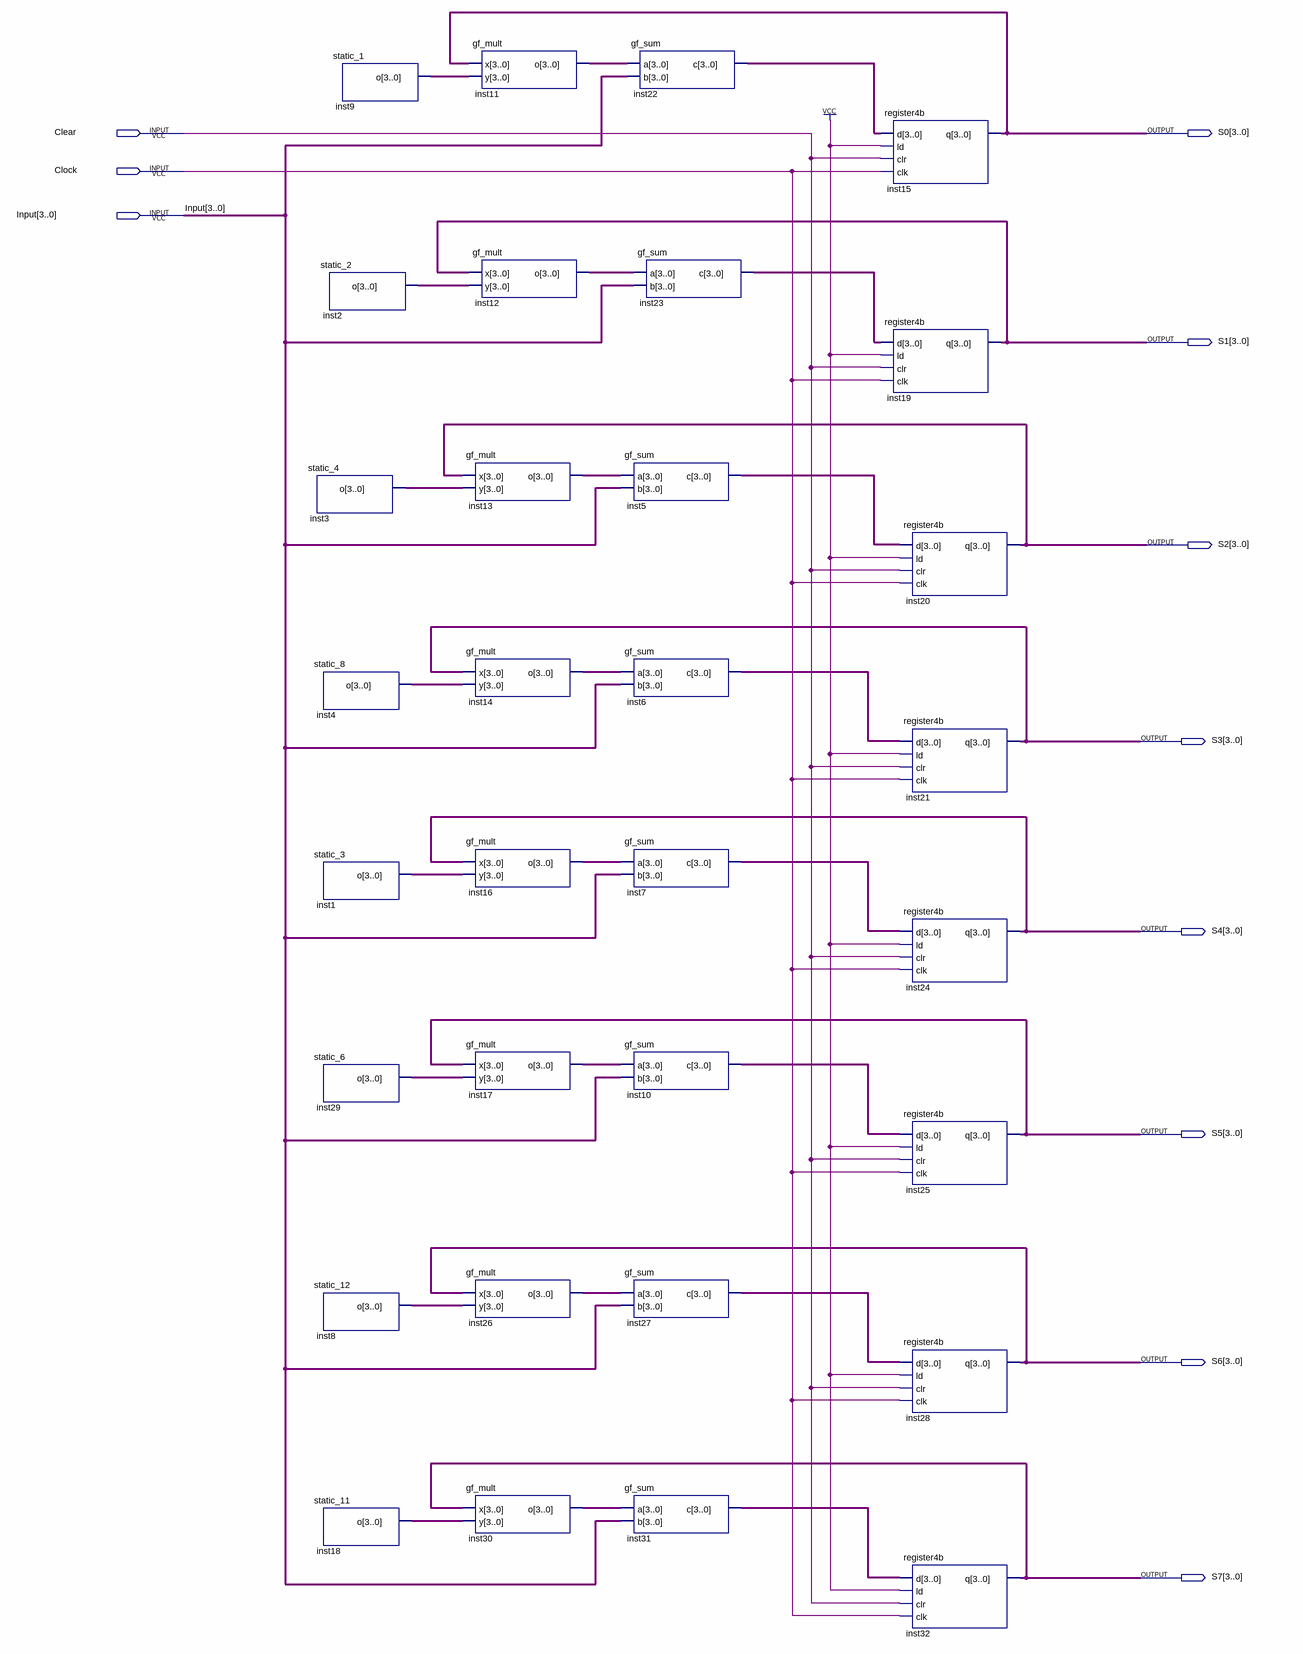
[diagram p0: schematic sheet]
// Quartus schematic Syndrome.bdf as structural Verilog: 32 symbols, 11 pins
module Syndrome (
  input  Clear,
  input  Clock,
  input  [3:0] Input,
  output [3:0] S0,
  output [3:0] S1,
  output [3:0] S2,
  output [3:0] S3,
  output [3:0] S4,
  output [3:0] S5,
  output [3:0] S6,
  output [3:0] S7
);

  wire [3:0] inst1_o, inst2_o, inst3_o, inst4_o, inst5_c, inst6_c, inst7_c, inst8_o, inst9_o, inst10_c,
       inst11_o, inst12_o, inst13_o, inst14_o, inst16_o, inst17_o, inst18_o, inst22_c, inst23_c, inst26_o,
       inst27_c, inst29_o, inst30_o, inst31_c;

  static_4 inst3 (.o(inst3_o));
  static_8 inst4 (.o(inst4_o));
  static_3 inst1 (.o(inst1_o));
  static_6 inst29 (.o(inst29_o));
  static_12 inst8 (.o(inst8_o));
  static_11 inst18 (.o(inst18_o));
  static_1 inst9 (.o(inst9_o));
  static_2 inst2 (.o(inst2_o));
  gf_mult inst13 (.x(S2), .y(inst3_o), .o(inst13_o));
  gf_mult inst14 (.x(S3), .y(inst4_o), .o(inst14_o));
  gf_mult inst16 (.x(S4), .y(inst1_o), .o(inst16_o));
  gf_mult inst17 (.x(S5), .y(inst29_o), .o(inst17_o));
  gf_mult inst26 (.x(S6), .y(inst8_o), .o(inst26_o));
  gf_mult inst30 (.x(S7), .y(inst18_o), .o(inst30_o));
  gf_mult inst11 (.x(S0), .y(inst9_o), .o(inst11_o));
  gf_mult inst12 (.x(S1), .y(inst2_o), .o(inst12_o));
  gf_sum inst22 (.a(inst11_o), .b(Input), .c(inst22_c));
  gf_sum inst23 (.a(inst12_o), .b(Input), .c(inst23_c));
  gf_sum inst5 (.a(inst13_o), .b(Input), .c(inst5_c));
  gf_sum inst6 (.a(inst14_o), .b(Input), .c(inst6_c));
  gf_sum inst7 (.a(inst16_o), .b(Input), .c(inst7_c));
  gf_sum inst10 (.a(inst17_o), .b(Input), .c(inst10_c));
  gf_sum inst27 (.a(inst26_o), .b(Input), .c(inst27_c));
  gf_sum inst31 (.a(inst30_o), .b(Input), .c(inst31_c));
  register4b inst15 (.d(inst22_c), .ld(1'b1), .clr(Clear), .clk(Clock), .q(S0));
  register4b inst19 (.d(inst23_c), .ld(1'b1), .clr(Clear), .clk(Clock), .q(S1));
  register4b inst20 (.d(inst5_c), .ld(1'b1), .clr(Clear), .clk(Clock), .q(S2));
  register4b inst21 (.d(inst6_c), .ld(1'b1), .clr(Clear), .clk(Clock), .q(S3));
  register4b inst24 (.d(inst7_c), .ld(1'b1), .clr(Clear), .clk(Clock), .q(S4));
  register4b inst25 (.d(inst10_c), .ld(1'b1), .clr(Clear), .clk(Clock), .q(S5));
  register4b inst28 (.d(inst27_c), .ld(1'b1), .clr(Clear), .clk(Clock), .q(S6));
  register4b inst32 (.d(inst31_c), .ld(1'b1), .clr(Clear), .clk(Clock), .q(S7));
endmodule
